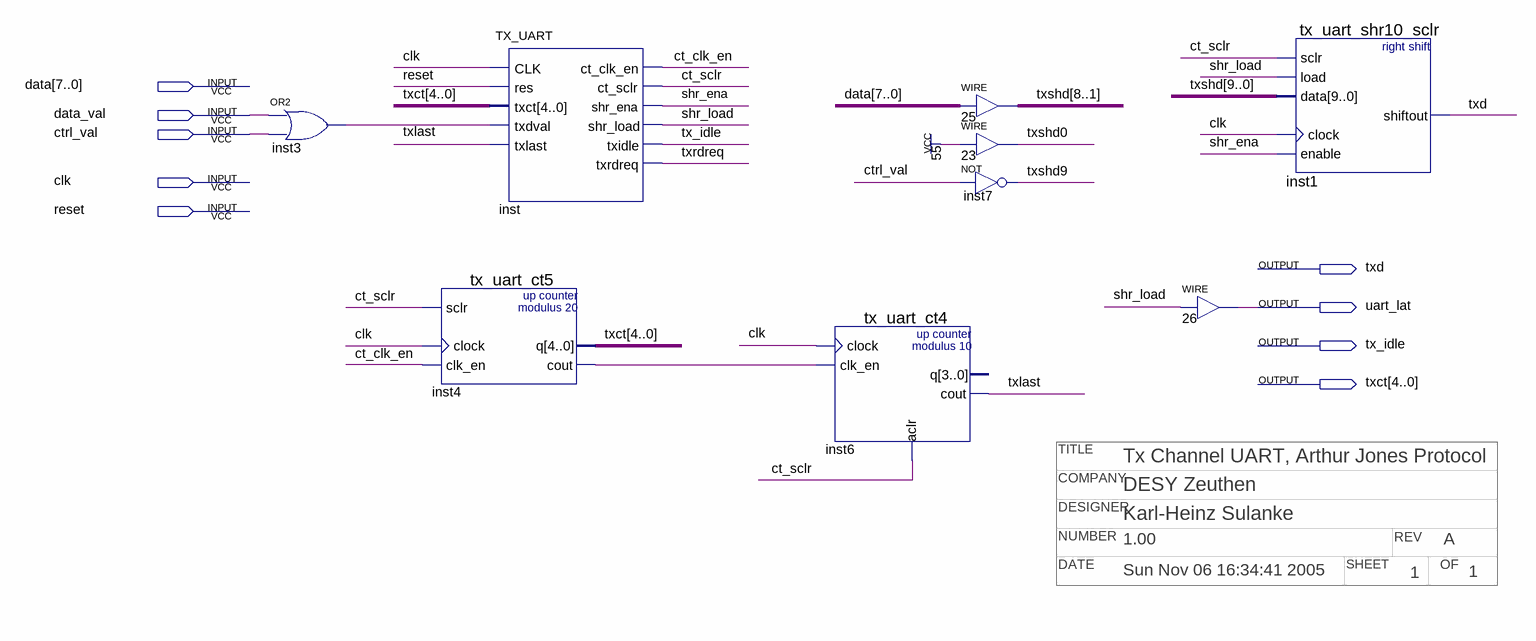
[diagram p0: schematic sheet]
// Quartus schematic tx_uart_ap.bdf as structural Verilog: 9 symbols, 9 pins
// Title block: TITLE: Tx Channel UART, Arthur Jones Protocol; COMPANY: DESY Zeuthen; DESIGNER: Karl-Heinz Sulanke; NUMBER: 1.00; REV: A; DATE: Sun Nov 06 16:34:41 2005; SHEET: 1; OF: 1
module tx_uart_ap (
  input  [7:0] data,
  input  data_val,
  input  ctrl_val,
  input  clk,
  input  reset,
  output txd,
  output uart_lat,
  output tx_idle,
  output [4:0] txct
);

  wire ct_clk_en, ct_sclr, inst3_out, inst4_cout, shr_ena, shr_load, txlast, txrdreq;
  wire [9:0] txshd;

  or inst3 (inst3_out, data_val, ctrl_val);
  TX_UART inst (
    .CLK(clk), .res(reset), .txct(txct), .txdval(inst3_out), .txlast(txlast), .ct_clk_en(ct_clk_en),
    .ct_sclr(ct_sclr), .shr_ena(shr_ena), .shr_load(shr_load), .txidle(tx_idle), .txrdreq(txrdreq));
  tx_uart_ct5 inst4 (.sclr(ct_sclr), .clock(clk), .clk_en(ct_clk_en), .q(txct), .cout(inst4_cout));
  tx_uart_ct4 inst6 (.clock(clk), .clk_en(inst4_cout), .aclr(ct_sclr), .cout(txlast));  // open: q
  assign txshd[8:1] = data;  // WIRE 25
  assign txshd[0] = 1'b1;  // WIRE 23
  not inst7 (txshd[9], ctrl_val);
  assign uart_lat = shr_load;  // WIRE 26
  tx_uart_shr10_sclr inst1 (
    .sclr(ct_sclr), .load(shr_load), .data(txshd), .clock(clk), .enable(shr_ena), .shiftout(txd));
endmodule
